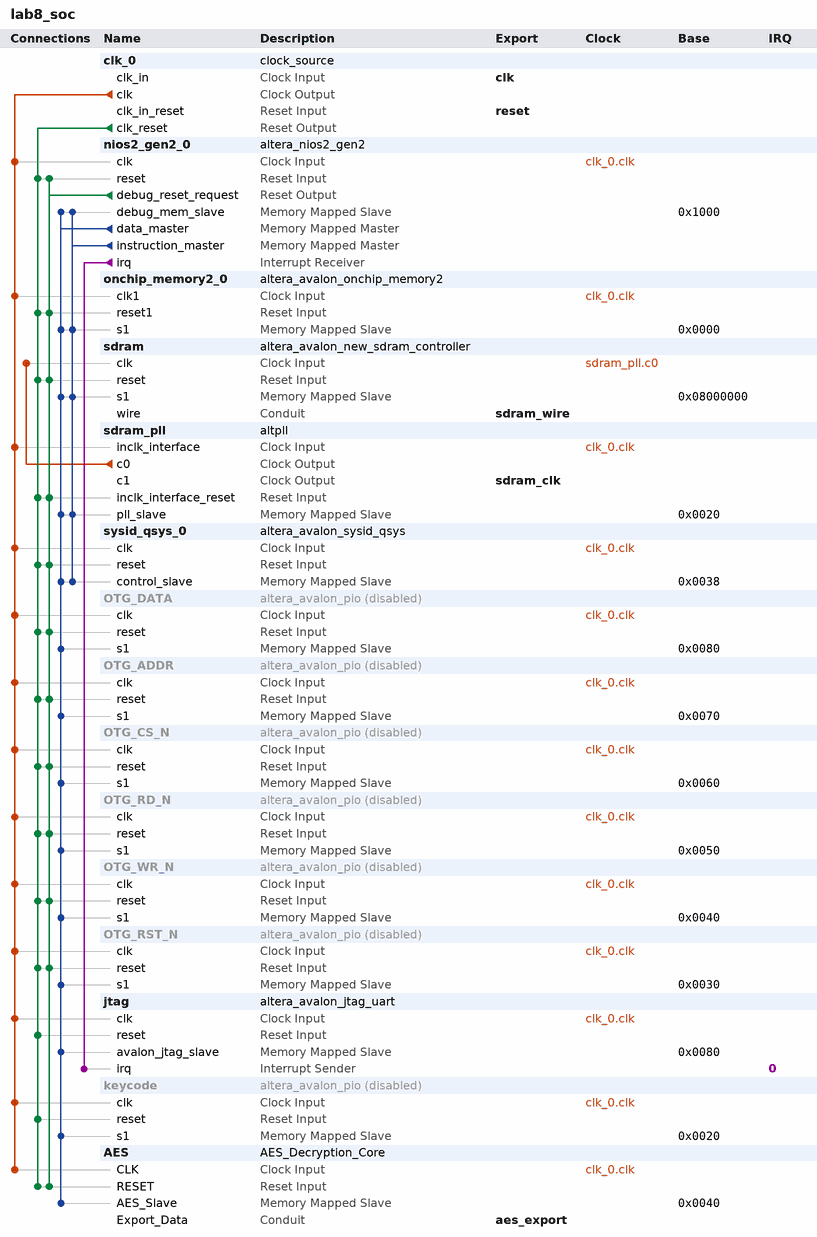
[diagram p0: system contents]
# Platform Designer (Qsys) system lab8_soc, Cyclone IV E EP4CE115F29C7
# Parameters at their usual value, and those the tool derives, are not listed.
package require -exact qsys 18.1
create_system lab8_soc
set_project_property DEVICE_FAMILY {Cyclone IV E}
set_project_property DEVICE EP4CE115F29C7

add_instance clk_0 clock_source 18.1
set_instance_parameter_value clk_0 clockFrequency 50000000

add_instance nios2_gen2_0 altera_nios2_gen2 18.1
set_instance_parameter_value nios2_gen2_0 dcache_size 2048
set_instance_parameter_value nios2_gen2_0 exceptionSlave sdram.s1
set_instance_parameter_value nios2_gen2_0 icache_size 4096
set_instance_parameter_value nios2_gen2_0 impl Tiny
set_instance_parameter_value nios2_gen2_0 resetSlave sdram.s1

add_instance onchip_memory2_0 altera_avalon_onchip_memory2 18.1
set_instance_parameter_value onchip_memory2_0 dataWidth 32
set_instance_parameter_value onchip_memory2_0 dualPort false
set_instance_parameter_value onchip_memory2_0 initMemContent true
set_instance_parameter_value onchip_memory2_0 initializationFileName onchip_mem.hex
set_instance_parameter_value onchip_memory2_0 memorySize 16

add_instance sdram altera_avalon_new_sdram_controller 18.1
set_instance_parameter_value sdram TAC 5.5
set_instance_parameter_value sdram TRCD 20.0
set_instance_parameter_value sdram TRP 20.0
set_instance_parameter_value sdram casLatency 3
set_instance_parameter_value sdram columnWidth 10
set_instance_parameter_value sdram dataWidth 32
set_instance_parameter_value sdram generateSimulationModel false
set_instance_parameter_value sdram model single_Micron_MT48LC4M32B2_7_chip
set_instance_parameter_value sdram numberOfBanks 2
set_instance_parameter_value sdram numberOfChipSelects 1
set_instance_parameter_value sdram powerUpDelay 200.0
set_instance_parameter_value sdram refreshPeriod 7.8125
set_instance_parameter_value sdram rowWidth 13

add_instance sdram_pll altpll 18.1
set_instance_parameter_value sdram_pll CLK0_DIVIDE_BY 1
set_instance_parameter_value sdram_pll CLK0_MULTIPLY_BY 1
set_instance_parameter_value sdram_pll CLK1_DIVIDE_BY 1
set_instance_parameter_value sdram_pll CLK1_DUTY_CYCLE 50
set_instance_parameter_value sdram_pll CLK1_MULTIPLY_BY 1
set_instance_parameter_value sdram_pll CLK1_PHASE_SHIFT -3000
set_instance_parameter_value sdram_pll INCLK0_INPUT_FREQUENCY 20000
set_instance_parameter_value sdram_pll PORT_ARESET PORT_UNUSED
set_instance_parameter_value sdram_pll PORT_LOCKED PORT_UNUSED
set_instance_parameter_value sdram_pll PORT_clk1 PORT_USED
set_instance_parameter_value sdram_pll PORT_clk2 PORT_UNUSED
set_instance_parameter_value sdram_pll PORT_clk3 PORT_UNUSED

add_instance sysid_qsys_0 altera_avalon_sysid_qsys 18.1
set_instance_parameter_value sysid_qsys_0 id 67

add_instance OTG_DATA altera_avalon_pio 18.1
set_instance_property OTG_DATA ENABLED false
set_instance_parameter_value OTG_DATA direction InOut
set_instance_parameter_value OTG_DATA width 16

add_instance OTG_ADDR altera_avalon_pio 18.1
set_instance_property OTG_ADDR ENABLED false
set_instance_parameter_value OTG_ADDR direction Output
set_instance_parameter_value OTG_ADDR width 2

add_instance OTG_CS_N altera_avalon_pio 18.1
set_instance_property OTG_CS_N ENABLED false
set_instance_parameter_value OTG_CS_N direction Output
set_instance_parameter_value OTG_CS_N width 1

add_instance OTG_RD_N altera_avalon_pio 18.1
set_instance_property OTG_RD_N ENABLED false
set_instance_parameter_value OTG_RD_N direction Output
set_instance_parameter_value OTG_RD_N width 1

add_instance OTG_WR_N altera_avalon_pio 18.1
set_instance_property OTG_WR_N ENABLED false
set_instance_parameter_value OTG_WR_N direction Output
set_instance_parameter_value OTG_WR_N width 1

add_instance OTG_RST_N altera_avalon_pio 18.1
set_instance_property OTG_RST_N ENABLED false
set_instance_parameter_value OTG_RST_N direction Output
set_instance_parameter_value OTG_RST_N width 1

add_instance jtag altera_avalon_jtag_uart 18.1
set_instance_parameter_value jtag simInteractiveOptions NO_INTERACTIVE_WINDOWS

add_instance keycode altera_avalon_pio 18.1
set_instance_property keycode ENABLED false
set_instance_parameter_value keycode direction Output
set_instance_parameter_value keycode width 8

add_instance AES AES_Decryption_Core 1.0

# connections
add_connection clk_0.clk AES.CLK clock
add_connection clk_0.clk jtag.clk clock
add_connection clk_0.clk keycode.clk clock
add_connection clk_0.clk nios2_gen2_0.clk clock
add_connection clk_0.clk onchip_memory2_0.clk1 clock
add_connection clk_0.clk OTG_ADDR.clk clock
add_connection clk_0.clk OTG_CS_N.clk clock
add_connection clk_0.clk OTG_DATA.clk clock
add_connection clk_0.clk OTG_RD_N.clk clock
add_connection clk_0.clk OTG_RST_N.clk clock
add_connection clk_0.clk OTG_WR_N.clk clock
add_connection clk_0.clk sdram_pll.inclk_interface clock
add_connection clk_0.clk sysid_qsys_0.clk clock
add_connection sdram_pll.c0 sdram.clk clock
add_connection clk_0.clk_reset AES.RESET reset
add_connection clk_0.clk_reset jtag.reset reset
add_connection clk_0.clk_reset keycode.reset reset
add_connection clk_0.clk_reset nios2_gen2_0.reset reset
add_connection clk_0.clk_reset onchip_memory2_0.reset1 reset
add_connection clk_0.clk_reset OTG_ADDR.reset reset
add_connection clk_0.clk_reset OTG_CS_N.reset reset
add_connection clk_0.clk_reset OTG_DATA.reset reset
add_connection clk_0.clk_reset OTG_RD_N.reset reset
add_connection clk_0.clk_reset OTG_RST_N.reset reset
add_connection clk_0.clk_reset OTG_WR_N.reset reset
add_connection clk_0.clk_reset sdram.reset reset
add_connection clk_0.clk_reset sdram_pll.inclk_interface_reset reset
add_connection clk_0.clk_reset sysid_qsys_0.reset reset
add_connection nios2_gen2_0.debug_reset_request AES.RESET reset
add_connection nios2_gen2_0.debug_reset_request nios2_gen2_0.reset reset
add_connection nios2_gen2_0.debug_reset_request onchip_memory2_0.reset1 reset
add_connection nios2_gen2_0.debug_reset_request OTG_ADDR.reset reset
add_connection nios2_gen2_0.debug_reset_request OTG_CS_N.reset reset
add_connection nios2_gen2_0.debug_reset_request OTG_DATA.reset reset
add_connection nios2_gen2_0.debug_reset_request OTG_RD_N.reset reset
add_connection nios2_gen2_0.debug_reset_request OTG_RST_N.reset reset
add_connection nios2_gen2_0.debug_reset_request OTG_WR_N.reset reset
add_connection nios2_gen2_0.debug_reset_request sdram.reset reset
add_connection nios2_gen2_0.debug_reset_request sdram_pll.inclk_interface_reset reset
add_connection nios2_gen2_0.debug_reset_request sysid_qsys_0.reset reset
add_connection nios2_gen2_0.data_master AES.AES_Slave avalon
set_connection_parameter_value nios2_gen2_0.data_master/AES.AES_Slave baseAddress 0x0040
add_connection nios2_gen2_0.data_master jtag.avalon_jtag_slave avalon
set_connection_parameter_value nios2_gen2_0.data_master/jtag.avalon_jtag_slave baseAddress 0x0080
add_connection nios2_gen2_0.data_master keycode.s1 avalon
set_connection_parameter_value nios2_gen2_0.data_master/keycode.s1 baseAddress 0x0020
add_connection nios2_gen2_0.data_master nios2_gen2_0.debug_mem_slave avalon
set_connection_parameter_value nios2_gen2_0.data_master/nios2_gen2_0.debug_mem_slave baseAddress 0x1000
add_connection nios2_gen2_0.data_master onchip_memory2_0.s1 avalon
set_connection_parameter_value nios2_gen2_0.data_master/onchip_memory2_0.s1 baseAddress 0x0000
add_connection nios2_gen2_0.data_master OTG_ADDR.s1 avalon
set_connection_parameter_value nios2_gen2_0.data_master/OTG_ADDR.s1 baseAddress 0x0070
add_connection nios2_gen2_0.data_master OTG_CS_N.s1 avalon
set_connection_parameter_value nios2_gen2_0.data_master/OTG_CS_N.s1 baseAddress 0x0060
add_connection nios2_gen2_0.data_master OTG_DATA.s1 avalon
set_connection_parameter_value nios2_gen2_0.data_master/OTG_DATA.s1 baseAddress 0x0080
add_connection nios2_gen2_0.data_master OTG_RD_N.s1 avalon
set_connection_parameter_value nios2_gen2_0.data_master/OTG_RD_N.s1 baseAddress 0x0050
add_connection nios2_gen2_0.data_master OTG_RST_N.s1 avalon
set_connection_parameter_value nios2_gen2_0.data_master/OTG_RST_N.s1 baseAddress 0x0030
add_connection nios2_gen2_0.data_master OTG_WR_N.s1 avalon
set_connection_parameter_value nios2_gen2_0.data_master/OTG_WR_N.s1 baseAddress 0x0040
add_connection nios2_gen2_0.data_master sdram.s1 avalon
set_connection_parameter_value nios2_gen2_0.data_master/sdram.s1 baseAddress 0x08000000
add_connection nios2_gen2_0.data_master sdram_pll.pll_slave avalon
set_connection_parameter_value nios2_gen2_0.data_master/sdram_pll.pll_slave baseAddress 0x0020
add_connection nios2_gen2_0.data_master sysid_qsys_0.control_slave avalon
set_connection_parameter_value nios2_gen2_0.data_master/sysid_qsys_0.control_slave baseAddress 0x0038
add_connection nios2_gen2_0.instruction_master nios2_gen2_0.debug_mem_slave avalon
set_connection_parameter_value nios2_gen2_0.instruction_master/nios2_gen2_0.debug_mem_slave baseAddress 0x1000
add_connection nios2_gen2_0.instruction_master onchip_memory2_0.s1 avalon
set_connection_parameter_value nios2_gen2_0.instruction_master/onchip_memory2_0.s1 baseAddress 0x0000
add_connection nios2_gen2_0.instruction_master sdram.s1 avalon
set_connection_parameter_value nios2_gen2_0.instruction_master/sdram.s1 baseAddress 0x08000000
add_connection nios2_gen2_0.instruction_master sdram_pll.pll_slave avalon
set_connection_parameter_value nios2_gen2_0.instruction_master/sdram_pll.pll_slave baseAddress 0x0020
add_connection nios2_gen2_0.instruction_master sysid_qsys_0.control_slave avalon
set_connection_parameter_value nios2_gen2_0.instruction_master/sysid_qsys_0.control_slave baseAddress 0x0038
add_connection nios2_gen2_0.irq jtag.irq interrupt
set_connection_parameter_value nios2_gen2_0.irq/jtag.irq irqNumber 0

# exported interfaces
add_interface aes_export conduit end
set_interface_property aes_export EXPORT_OF AES.Export_Data
add_interface clk clock sink
set_interface_property clk EXPORT_OF clk_0.clk_in
add_interface reset reset sink
set_interface_property reset EXPORT_OF clk_0.clk_in_reset
add_interface sdram_clk clock source
set_interface_property sdram_clk EXPORT_OF sdram_pll.c1
add_interface sdram_wire conduit end
set_interface_property sdram_wire EXPORT_OF sdram.wire

set_interconnect_requirement {$system} qsys_mm.clockCrossingAdapter HANDSHAKE
set_interconnect_requirement {$system} qsys_mm.enableEccProtection FALSE
set_interconnect_requirement {$system} qsys_mm.insertDefaultSlave FALSE
set_interconnect_requirement {$system} qsys_mm.maxAdditionalLatency 1

save_system lab8_soc.qsys
